# EAGLE schematic attiny84_rgb (EAGLE 6.1)
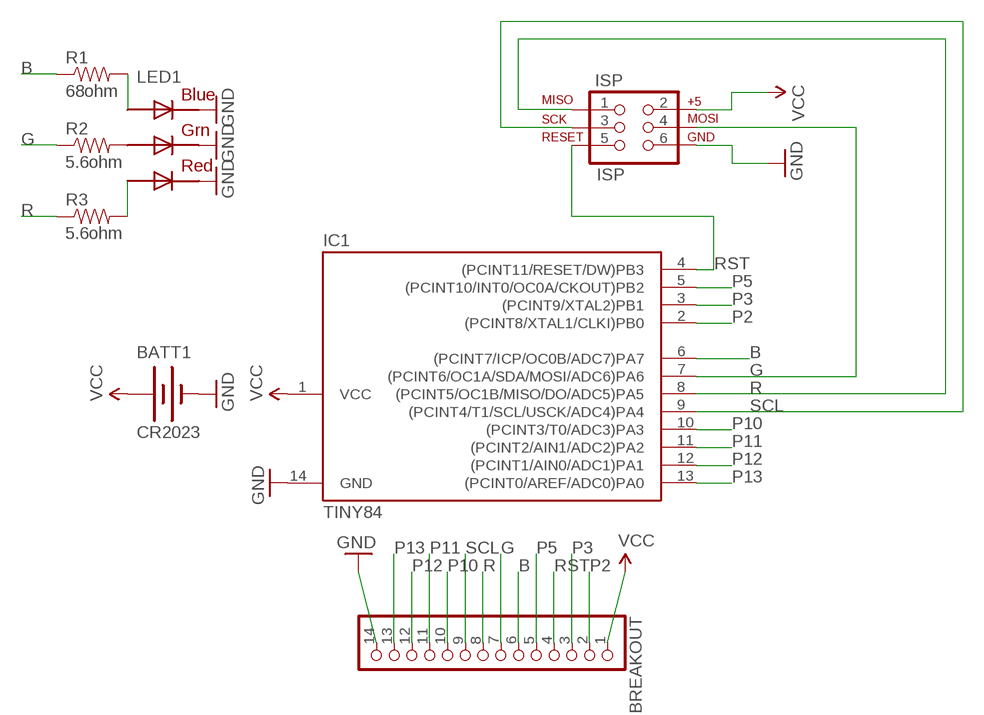
[diagram p0: schematic, sheet 1]

## Parts
BATT1  CR2023  BATTERY12MM  [BATTCON_12MM]
BREAKOUT  PINHD-1X14  [1X14]
IC1  TINY84  TINY24/44/84-SSU  [SOIC14]
ISP  ISP  AVR_SPI_PRG_6NS  [2X3-NS]
LED1  LED1  RGBLED5050  [RGBLED5050]
R1  68ohm  RESISTOR1206  [1206]
R2  5.6ohm  RESISTOR1206  [1206]
R3  5.6ohm  RESISTOR1206  [1206]

## Nets
B: BREAKOUT.6 IC1.6((PCINT7/ICP/OC0B/ADC7)PA7) R1.1
G: BREAKOUT.7 IC1.7((PCINT6/OC1A/SDA/MOSI/ADC6)PA6) ISP.4 R2.1
GND: BATT1.GND(-) BREAKOUT.14 IC1.14(GND) ISP.6 LED1.4(BLUE_C) LED1.5(RED_C) LED1.6(GREEN_C)
N$1: LED1.3(BLUE_A) R1.2
N$2: LED1.1(GREEN_A) R2.2
N$3: LED1.2(RED_A) R3.2
P2: BREAKOUT.2 IC1.2((PCINT8/XTAL1/CLKI)PB0)
P3: BREAKOUT.3 IC1.3((PCINT9/XTAL2)PB1)
P5: BREAKOUT.5 IC1.5((PCINT10/INT0/OC0A/CKOUT)PB2)
P10: BREAKOUT.10 IC1.10((PCINT3/T0/ADC3)PA3)
P11: BREAKOUT.11 IC1.11((PCINT2/AIN1/ADC2)PA2)
P12: BREAKOUT.12 IC1.12((PCINT1/AIN0/ADC1)PA1)
P13: BREAKOUT.13 IC1.13((PCINT0/AREF/ADC0)PA0)
R: BREAKOUT.8 IC1.8((PCINT5/OC1B/MISO/DO/ADC5)PA5) ISP.1 R3.1
RST: BREAKOUT.4 IC1.4((PCINT11/RESET/DW)PB3) ISP.5
SCL: BREAKOUT.9 IC1.9((PCINT4/T1/SCL/USCK/ADC4)PA4) ISP.3
VCC: BATT1.PWR@1(+) BREAKOUT.1 IC1.1(VCC) ISP.2

## Library data of the parts
BATT1 = SparkFun:BATTERY: Battery Holders Various common sizes : AA, AAA, 20mm coin cell and 12mm coin cell.
BREAKOUT = adafruit:PINHD-1X14: PIN HEADER
IC1 = avr-7:TINY24/44/84
ISP = SparkFun:AVR_SPI_PRG_6: AVR ISP 6 Pin This is the reduced ISP connector for AVR programming. Common on Arduino. This footprint will take up less PCB space and can be used with a 10-pin to 6-pin adapter such as SKU: BOB-08508
LED1 = adafruit:RGBLED: For 5050 RGB LEDs, the order of the LEDs may vary from one manufacturer to another!
R1-R3 = SparkFun:RESISTOR: Resistor Basic schematic elements and footprints for 0603, 1206, and PTH resistors.